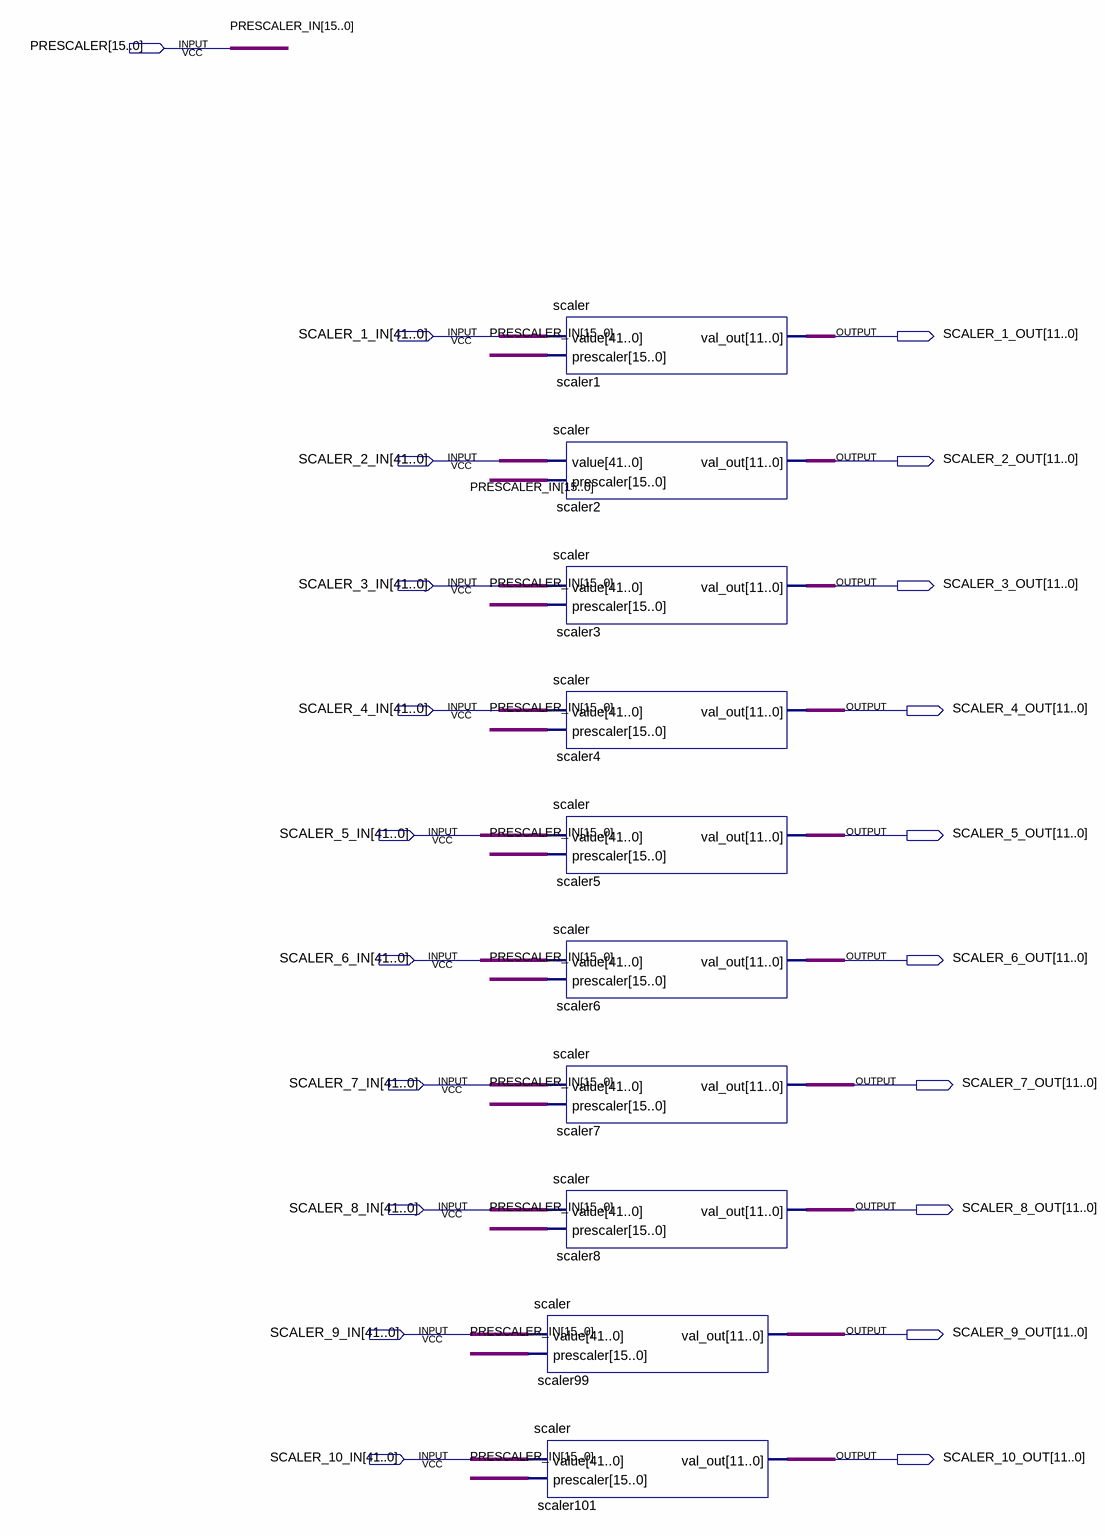
[diagram p0: schematic sheet]
// Quartus schematic ScalerBlock.bdf as structural Verilog: 10 symbols, 21 pins
module ScalerBlock (
  input  [15:0] PRESCALER,
  input  [41:0] SCALER_1_IN,
  input  [41:0] SCALER_2_IN,
  input  [41:0] SCALER_3_IN,
  input  [41:0] SCALER_4_IN,
  input  [41:0] SCALER_5_IN,
  input  [41:0] SCALER_6_IN,
  input  [41:0] SCALER_7_IN,
  input  [41:0] SCALER_8_IN,
  input  [41:0] SCALER_9_IN,
  input  [41:0] SCALER_10_IN,
  output [11:0] SCALER_1_OUT,
  output [11:0] SCALER_2_OUT,
  output [11:0] SCALER_3_OUT,
  output [11:0] SCALER_4_OUT,
  output [11:0] SCALER_5_OUT,
  output [11:0] SCALER_6_OUT,
  output [11:0] SCALER_7_OUT,
  output [11:0] SCALER_8_OUT,
  output [11:0] SCALER_9_OUT,
  output [11:0] SCALER_10_OUT
);

  scaler scaler1 (.value(SCALER_1_IN), .prescaler(PRESCALER), .val_out(SCALER_1_OUT));
  scaler scaler2 (.value(SCALER_2_IN), .prescaler(PRESCALER), .val_out(SCALER_2_OUT));
  scaler scaler3 (.value(SCALER_3_IN), .prescaler(PRESCALER), .val_out(SCALER_3_OUT));
  scaler scaler4 (.value(SCALER_4_IN), .prescaler(PRESCALER), .val_out(SCALER_4_OUT));
  scaler scaler5 (.value(SCALER_5_IN), .prescaler(PRESCALER), .val_out(SCALER_5_OUT));
  scaler scaler6 (.value(SCALER_6_IN), .prescaler(PRESCALER), .val_out(SCALER_6_OUT));
  scaler scaler7 (.value(SCALER_7_IN), .prescaler(PRESCALER), .val_out(SCALER_7_OUT));
  scaler scaler8 (.value(SCALER_8_IN), .prescaler(PRESCALER), .val_out(SCALER_8_OUT));
  scaler scaler99 (.value(SCALER_9_IN), .prescaler(PRESCALER), .val_out(SCALER_9_OUT));
  scaler scaler101 (.value(SCALER_10_IN), .prescaler(PRESCALER), .val_out(SCALER_10_OUT));

  // Other names for the same wires on the sheet: PRESCALER_IN[15:0] = PRESCALER
endmodule
